# Altium schematic sheet satellite.SchDoc
size A4; Organization: Arribada Initiative; Address1: https://github.com/arribada; Address2: contact@arribada.org; Address3: arribada.org; Address4: UK - Portsmouth; DocumentNumber: 11; SheetNumber: 11; SheetTotal: 13
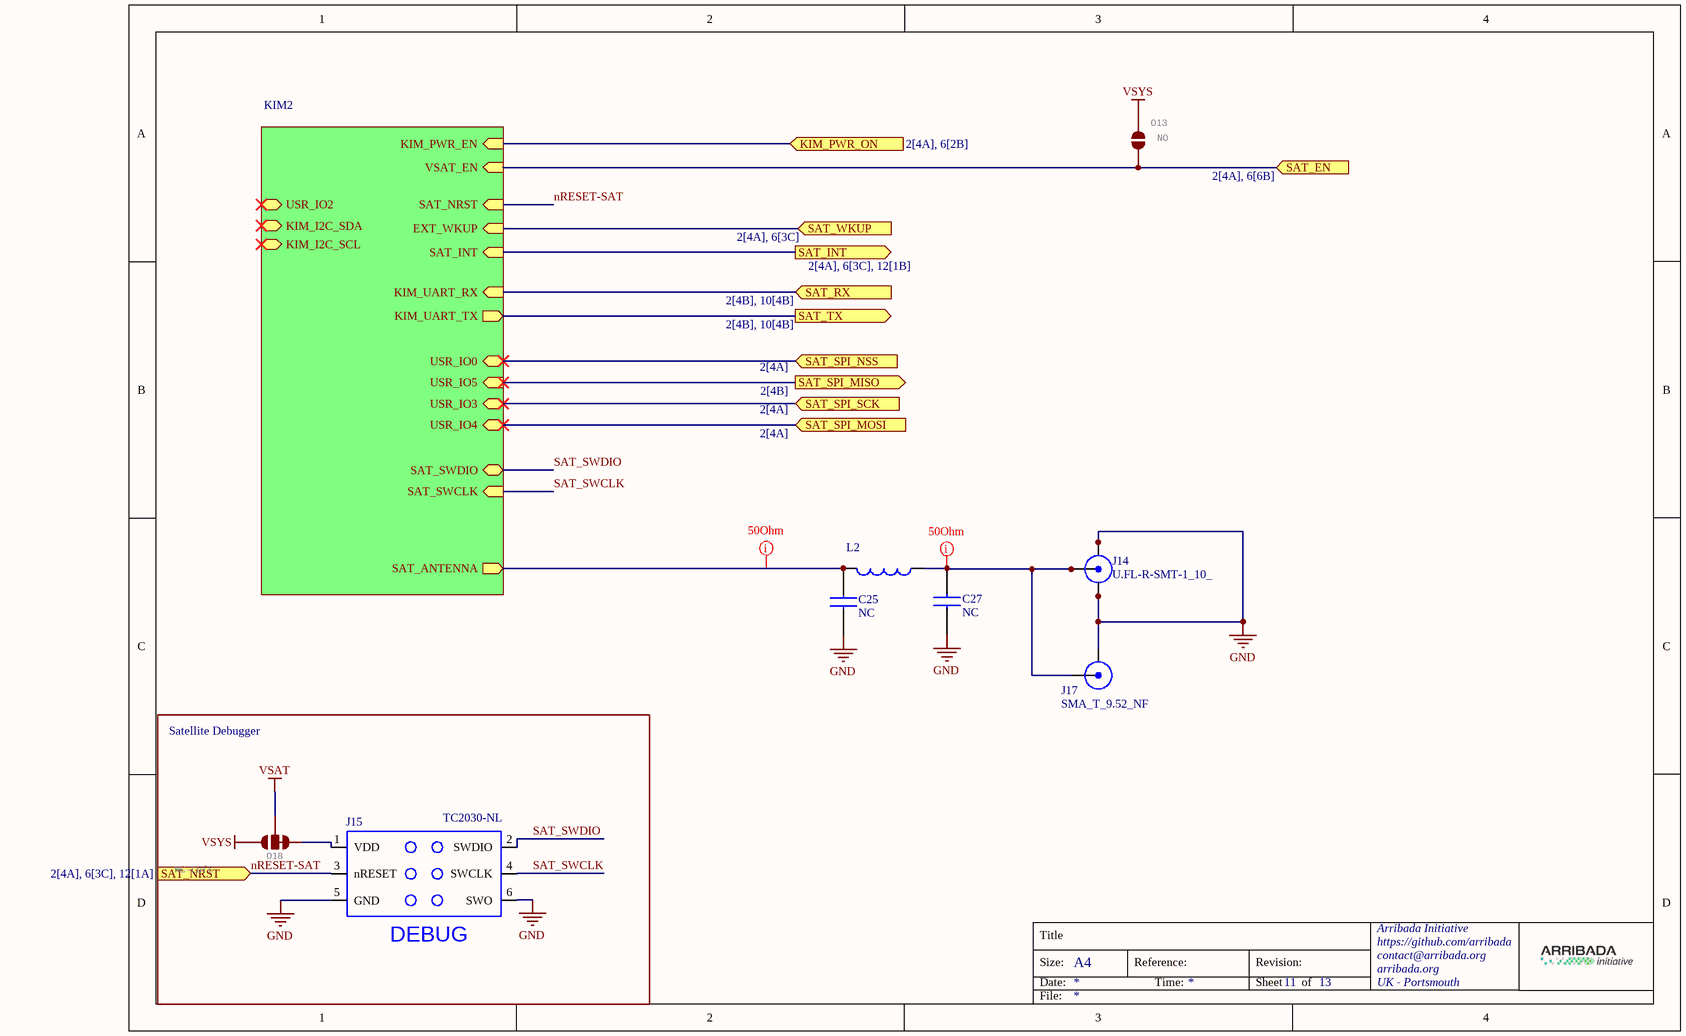
[diagram p0: satellite.SchDoc]

## Parts
C25  NC  [CAPC1005X55N]
C27  NC  [CAPC1005X55N]
J14  U.FL-R-SMT-1_10_  [U.FL-R-SMT-1(10)]
J15  TC2030-NL  [TC2030NL]
J17  SMA_T_9.52_NF  [CO_SAMTEC_SMA-J-P-ST-EMI]
L2  (no value)  [LQW18AN10NG80D]
O13  NO  [SMT-JUMPER_2_NO_TRACE_SILK]  (net tie, no BOM)
O18  NC-Left  [SMT-JUMPER_3_2-NCLEFT_TRACE_SILK]  (net tie, no BOM)

## Blocks framed on the sheet
Satellite Debugger: J15 O18

## Sub-sheets
KIM2 = sat-kim2.SchDoc: KIM_UART_TX (out), KIM_UART_RX (in), KIM_I2C_SDA (bidir), KIM_I2C_SCL (bidir), VSAT_EN (in), EXT_WKUP (in), SAT_INT (in), USR_IO0 (bidir), USR_IO2 (bidir), USR_IO3 (bidir), USR_IO4 (bidir), USR_IO5 (in), SAT_NRST (in), SAT_SWDIO (bidir), SAT_SWCLK (in), SAT_ANTENNA (out), KIM_PWR_EN (in)

## Ports
KIM_PWR_ON (in, see 2[4A], 6[2B]), SAT_EN (in, see 2[4A], 6[6B]), SAT_INT (out, see 2[4A], 6[3C], 12[1B]), SAT_NRST (in, see 2[4A], 6[3C], 12[1A]), SAT_RX (in, see 2[4B], 10[4B]), SAT_SPI_MISO (out, see 2[4B]), SAT_SPI_MOSI (in, see 2[4A]), SAT_SPI_NSS (in, see 2[4A]), SAT_SPI_SCK (in, see 2[4A]), SAT_TX (out, see 2[4B], 10[4B]), SAT_WKUP (in, see 2[4A], 6[3C])

## Nets
GND: C25.1 C27.1 J14.1(Y) J14.2(Y) J15.5(GND) J15.6(SWO) J17.2(Y)
VSAT: O18.2
VSYS: O13.1 O18.3
KIM_PWR_ON: port KIM_PWR_ON, sheet KIM2/KIM_PWR_EN
nRESET-SAT: J15.3(nRESET) ; port SAT_NRST, sheet KIM2/SAT_NRST
SAT_EN: O13.2 ; port SAT_EN, sheet KIM2/VSAT_EN
SAT_INT: port SAT_INT, sheet KIM2/SAT_INT
SAT_RX: port SAT_RX, sheet KIM2/KIM_UART_RX
SAT_SPI_MISO: port SAT_SPI_MISO, sheet KIM2/USR_IO5
SAT_SPI_MOSI: port SAT_SPI_MOSI, sheet KIM2/USR_IO4
SAT_SPI_NSS: port SAT_SPI_NSS, sheet KIM2/USR_IO0
SAT_SPI_SCK: port SAT_SPI_SCK, sheet KIM2/USR_IO3
SAT_SWCLK: J15.4(SWCLK) ; sheet KIM2/SAT_SWCLK
SAT_SWDIO: J15.2(SWDIO) ; sheet KIM2/SAT_SWDIO
SAT_TX: port SAT_TX, sheet KIM2/KIM_UART_TX
SAT_WKUP: port SAT_WKUP, sheet KIM2/EXT_WKUP
NetC25_2: C25.2 L2.2 ; sheet KIM2/SAT_ANTENNA
NetC27_2: C27.2 J14.3(X) J17.1(X) L2.1
NetJ15_1: J15.1(VDD) O18.1

## Layout directives
rule Impedance Constraint [Min = 48.00    Max = 52.00    ]; net class 50R_Net: NetC25_2, NetC27_2

## Notes on the sheet
- Title
- Size:
- Date:
- A4
- Reference:
- Time:
- Revision:
- Sheet
- of
- File:
- (in symbol TC2030-NL) DEBUG

## Library data of the parts
C25 C27 = GEN_CAP_0402: Generic capacitor; ComponentLink1Description: Mouser; ComponentLink1URL: https://www.mouser.fr/ProductDetail/Murata-Electronics/GCM1555C1H4R7CA16D?qs=jDWTHf1mkXZYnVNtgyfFgw%3D%3D
J14 = U.FL-R-SMT-1_10_: UFL SMT PCB receptable,DC-6GHz Hirose Straight 50 Surface Mount UFL Connector, Receptacle, Solder Termination Coaxial; Description 1: Rf Connectors / Coaxial Connectors SMT Ml Rec Au 50 Ohm W/anti Sldr Wckng Rl; Category 1: RF / Coaxial Connectors; Body Material: Bronze; Body Plating: Silver; Dielectric Material: Polymer; Center Contact Plating: Gold; Impedance: 50R; Connector Type: Receptacle,Male Pin; Max Frequency: 6GHz; Number of Ports: 1; Mating Cycles: 30; Insulation Resistance: 500MR; Mouser Part Number: 798-U.FL-R-SMT-110; Mouser Price/Stock: https://www.mouser.co.uk/ProductDetail/Hirose-Connector/U.FL-R-SMT-110?qs=kL1ClTr6oBoOdtqlGQpQrQ%3D%3D; Manufacturer_Name: Hirose; Manufacturer_Part_Number: U.FL-R-SMT-1(10); Datasheet Link: https://www.hirose.com/product/document?clcode=CL0331-0472-2-10&productname=U.FL-R-SMT-1(10)&series=U.FL&documenttype=2DDrawing&lang=en&documentid=0000940684; Supplier 1: Mouser; Supplier Part Number 1: 798-U.FL-R-SMT-110; Manufacturer 1: Hirose; Manufacturer Part Number 1: U.FL-R-SMT-1(10); RoHS 1: Yes; Stock 1: 504085; Pricing 1: 1=1,44, 10=1,26, 50=1,26, 100=1,12, 1000=0,803, 10000=0,803 (USD); Mount: Surface Mount; Contact Material: Brass; Housing Color: Beige; Weight: 0.001764oz; Min Operating Temperature: -40°C; Max Operating Temperature: 90°C; Packaging: Tape and Reel; Package Quantity: 2500; Fastening Type: SNAP-ON; Termination: Solder; Series: U.FL; Orientation: Straight; Lead Free: Lead Free; RoHS Compliant: Yes; ComponentLink1URL: https://datasheet.ciiva.com/11762/0900766b8105243f-11762474.pdf?src-supplier=Rs; ComponentLink1Description: https://datasheet.ciiva.com/11762/0900766b8105243f-11762474.pdf?src-supplier=Rs; ComponentLink2URL: https://datasheet.ciiva.com/7651/91524-7651915.pdf?src-supplier=Element14; ComponentLink2Description: https://datasheet.ciiva.com/7651/91524-7651915.pdf?src-supplier=Element14; ComponentLink3URL: https://datasheet.ciiva.com/7651/91524-7651914.pdf?src-supplier=Element14; ComponentLink3Description: https://datasheet.ciiva.com/7651/91524-7651914.pdf?src-supplier=Element14
J15 = TC2030-NL: CON PLUG OF NAILS 6 PIN FOOTPRINT NO LEGS; Manufacturer: Tag-Connect; Manufacturers Part Number: NOT FITTED PART; Supplier Part Number 1: NOT FITTED PART; Supplier Part Number 2: NOT FITTED PART; Distributor 1: EBV; Distributor 2: Future Electronics
J17 = SMA_T_9.52_NF: SMA End Launch Jack 1.0 mm Board, 50 ohm; Manufacturer: COAX CONNECTORS LTD; Manufacturer_Part_Number: 30-462-D3-1.1mm
L2 = LQW18AN18NG8ZD: Inductor Wirewound , 18 nH, 75 Milliohm, ± 2%, 1.4 A, 0603 [1608 Metric]; Value: 18nH; Supplier 1: Mouser; Supplier Part Number 1: 81-LQW18AN18NG8ZD
O13 = JUMPER-SMT_2_NO_TRACE_SILK_1: Normally opened trace jumper / This jumper has no trace between two pads so it's normally closed (NO).; GateName_1: G$1; SymbolName_1: SMT-JUMPER_2_NC_TRACE; DeviceName: _SILK; DeviceSetName: JUMPER-SMT_2_NC_TRACE; LibraryName: SparkFun-Jumpers
O18 = JUMPER-SMT_3_2-NCLEFT_TRACE_SILK: Normally opened lefttrace jumper (1 of 2 connections)    This jumper has a trace between left pad pads so they are normally closed (NC). Use a razor knife to open the connection(s). For best results follow the IPC guidelines for cutting traces: Cutout at least 0.063 mm (0.005 in).  Remove all loose material to clean up the cut area.  Seal the cut with an approved epoxy.       Reapply solder to reclose the connection(s).; GateName_1: G$1; SymbolName_1: SMT-JUMPER_3_2-NC_TRACE; DeviceName: _SILK; DeviceSetName: JUMPER-SMT_3_2-NC_TRACE; LibraryName: SparkFun-Jumpers